# Altium schematic sheet MainBlockConnection.SchDoc
size A4; SheetNumber: 1; SheetTotal: 6
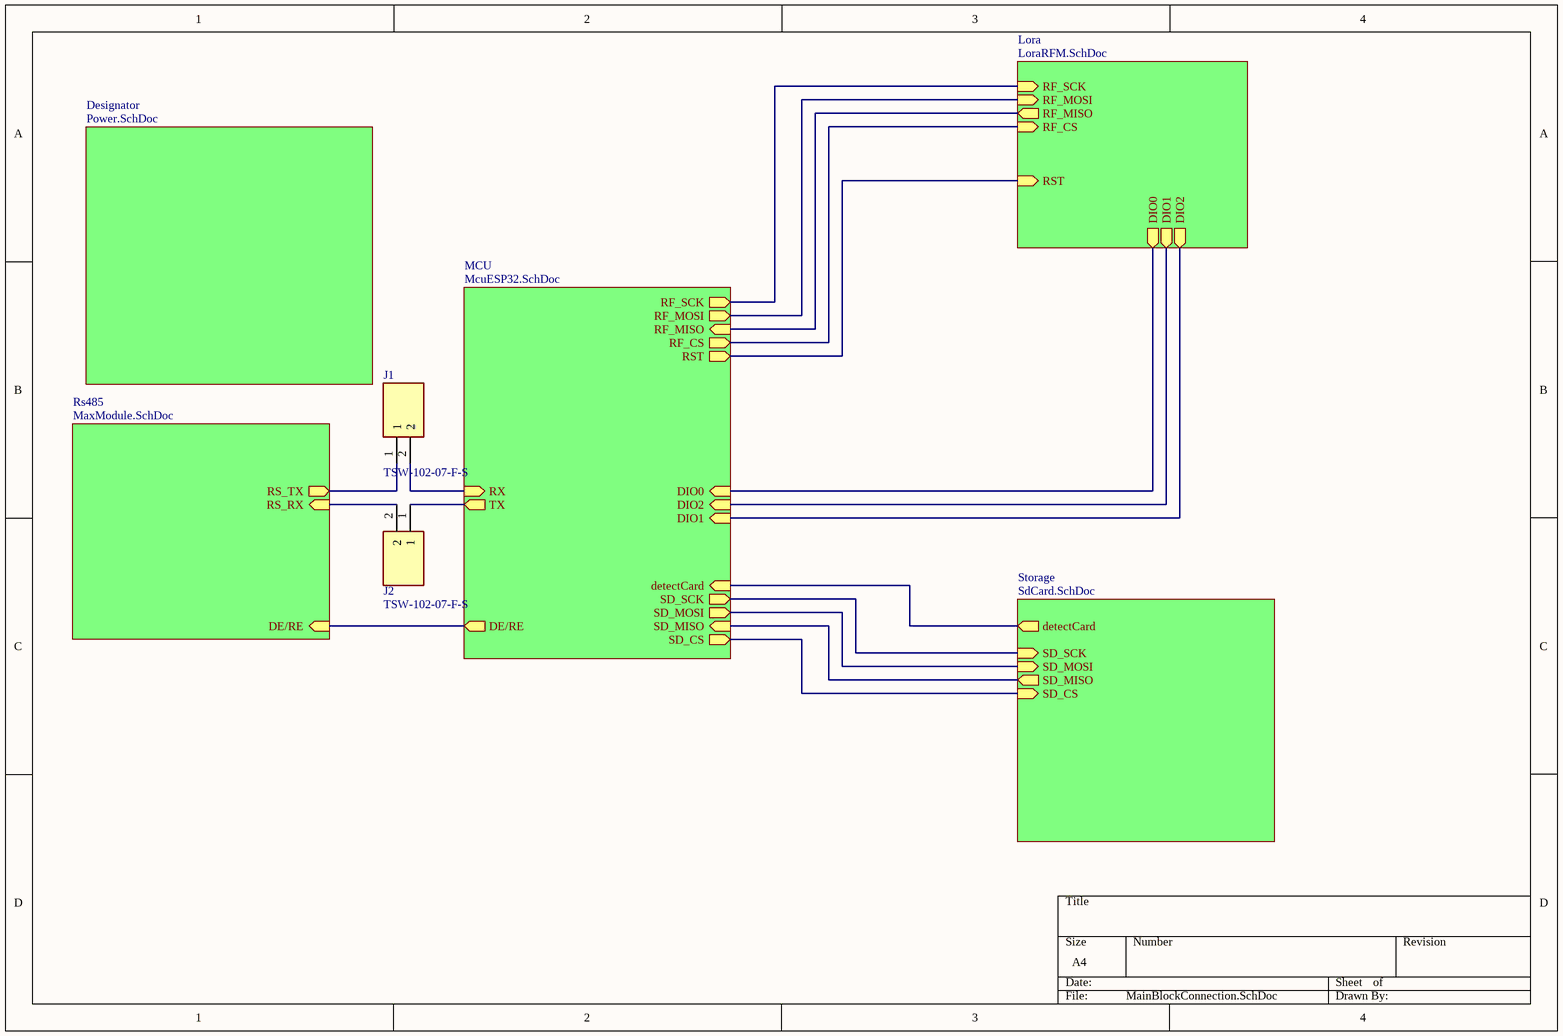
[diagram p0: MainBlockConnection.SchDoc]

## Parts
J1  TSW-102-07-F-S  [TSW-102-XX-YY-S]
J2  TSW-102-07-F-S  [TSW-102-XX-YY-S]

## Sub-sheets
Designator = Power.SchDoc: no entries
Lora = LoraRFM.SchDoc: RST (in), RF_MISO (out), RF_CS (in), RF_SCK (in), RF_MOSI (in), DIO0 (out), DIO1 (out), DIO2 (out)
MCU = McuESP32.SchDoc: TX (out), RX (in), RF_SCK (out), SD_MISO (in), SD_MOSI (out), RF_CS (out), SD_CS (out), SD_SCK (out), RF_MOSI (out), RF_MISO (in), RST (out), detectCard (in), DE/RE (out), DIO2 (in), DIO1 (in), DIO0 (in)
Rs485 = MaxModule.SchDoc: DE/RE (in), RS_TX (out), RS_RX (in)
Storage = SdCard.SchDoc: detectCard (out), SD_MOSI (in), SD_CS (in), SD_MISO (out), SD_SCK (in)

## Nets
NetJ1_1: J1.1 ; sheet Rs485/RS_TX
NetJ1_2: J1.2 ; sheet MCU/RX
NetJ2_1: J2.1 ; sheet MCU/TX
NetJ2_2: J2.2 ; sheet Rs485/RS_RX
(unnamed): sheet MCU/RF_SCK, sheet Lora/RF_SCK
(unnamed): sheet MCU/SD_MISO, sheet Storage/SD_MISO
(unnamed): sheet MCU/SD_MOSI, sheet Storage/SD_MOSI
(unnamed): sheet MCU/RF_CS, sheet Lora/RF_CS
(unnamed): sheet MCU/SD_CS, sheet Storage/SD_CS
(unnamed): sheet MCU/SD_SCK, sheet Storage/SD_SCK
(unnamed): sheet MCU/RF_MOSI, sheet Lora/RF_MOSI
(unnamed): sheet MCU/RF_MISO, sheet Lora/RF_MISO
(unnamed): sheet MCU/RST, sheet Lora/RST
(unnamed): sheet MCU/detectCard, sheet Storage/detectCard
(unnamed): sheet MCU/DE/RE, sheet Rs485/DE/RE
(unnamed): sheet MCU/DIO2, sheet Lora/DIO1
(unnamed): sheet MCU/DIO1, sheet Lora/DIO2
(unnamed): sheet MCU/DIO0, sheet Lora/DIO0

## Library data of the parts
J1 J2 = TSW-102-07-F-S: Connector; Manufacturer_Name: SAMTEC; Datasheet Link: http://suddendocs.samtec.com/prints/tsw-xxx-xx-xxx-x-xx-xxx-mkt.pdf; Manufacturer_Part_Number: TSW-102-07-F-S; Mouser Part Number: 200-TSW10207FS; Mouser Price/Stock: https://www.mouser.co.uk/ProductDetail/Samtec/TSW-102-07-F-S?qs=hzq9O0YpnZuC7JuvEqrjIA%3D%3D; Arrow Part Number: TSW-102-07-F-S; Arrow Price/Stock: https://www.arrow.com/en/products/tsw-102-07-f-s/samtec?utm_currency=USD&region=europe